# Altium schematic sheet LoRa_Transceiver.SchDoc
size A4; SheetNumber: 8; SheetTotal: 8
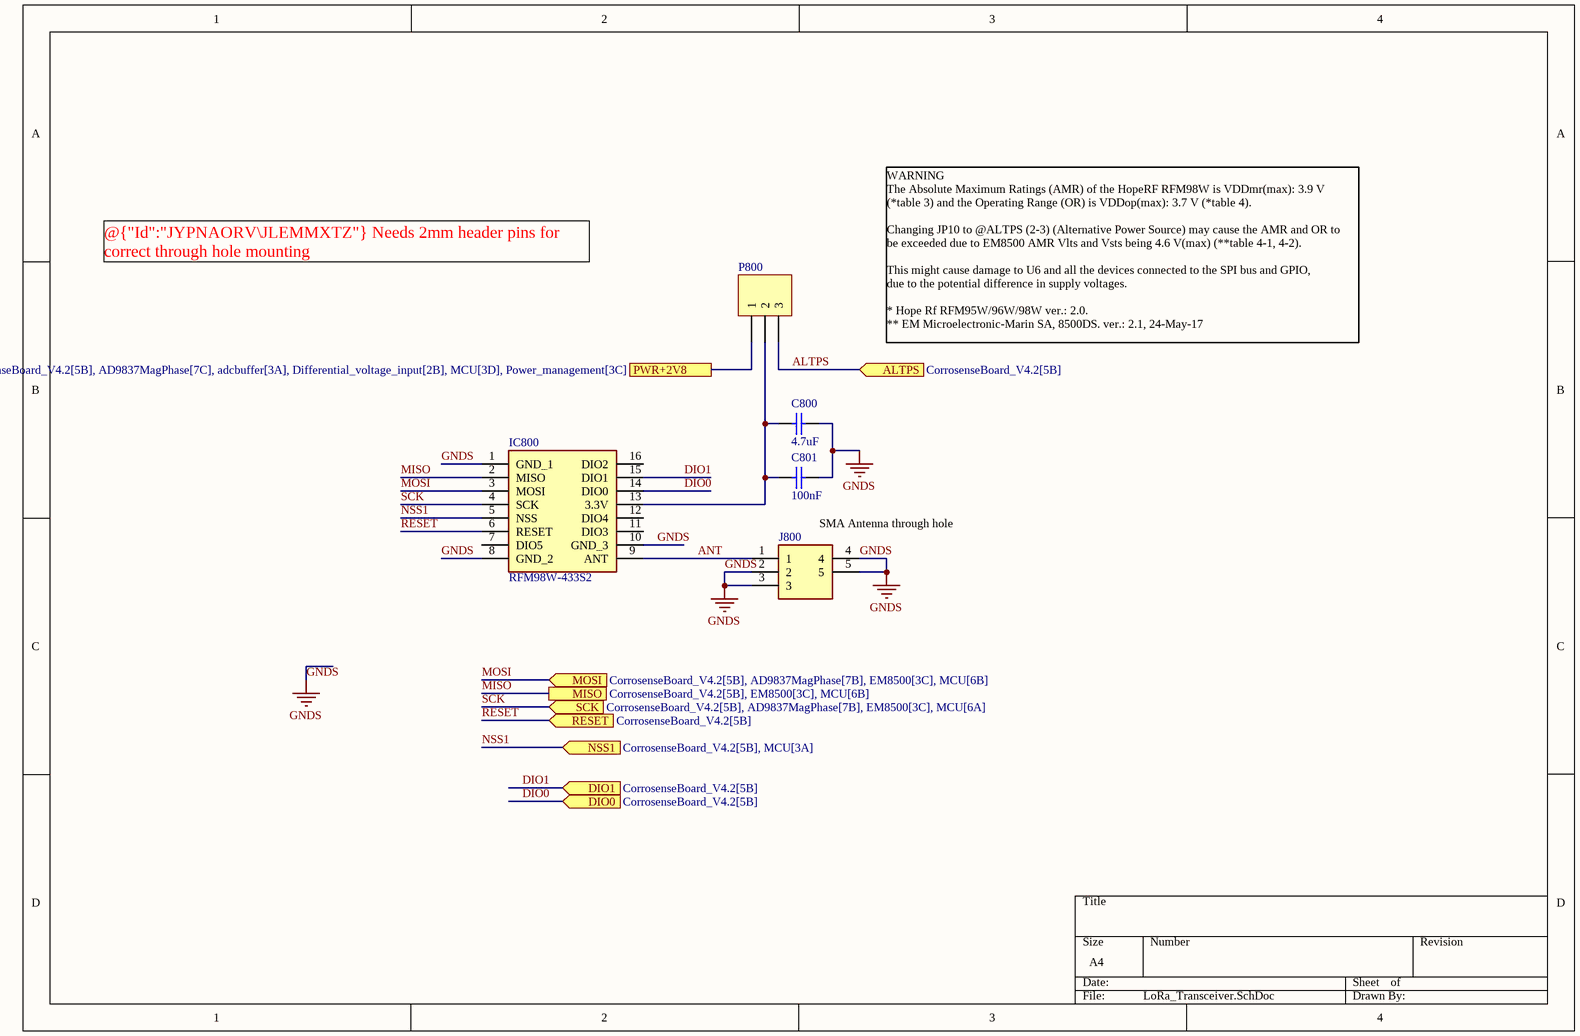
[diagram p0: LoRa_Transceiver.SchDoc]

## Parts
C800  4.7uF  [1608[0603]]
C801  100nF  [1608[0603]]
IC800  RFM98W-433S2  [RFM98W433S2]
J800  0733910070  [733910070]  (value not drawn)
P800  Header, 3-Pin  [HDR1X3]  (value not drawn)

## Ports
ALTPS (in, see CorrosenseBoard_V4.2[5B]), DIO0 (in, see CorrosenseBoard_V4.2[5B]), DIO1 (in, see CorrosenseBoard_V4.2[5B]), MISO (see CorrosenseBoard_V4.2[5B], EM8500[3C], MCU[6B]), MOSI (in, see CorrosenseBoard_V4.2[5B], AD9837MagPhase[7B], EM8500[3C], MCU[6B]), NSS1 (in, see CorrosenseBoard_V4.2[5B], MCU[3A]), PWR+2V8 (see CorrosenseBoard_V4.2[5B], AD9837MagPhase[7C], adcbuffer[3A], Differential_voltage_input[2B], MCU[3D], Power_management[3C]), RESET (in, see CorrosenseBoard_V4.2[5B]), SCK (in, see CorrosenseBoard_V4.2[5B], AD9837MagPhase[7B], EM8500[3C], MCU[6A])

## Nets
GNDS: C800.1 C801.1 IC800.1(GND_1) IC800.8(GND_2) IC800.10(GND_3) J800.2 J800.3 J800.4 J800.5
ALTPS: P800.3 ; port ALTPS
ANT: IC800.9(ANT) J800.1
DIO0: IC800.14(DIO0) ; port DIO0
DIO1: IC800.15(DIO1) ; port DIO1
MISO: IC800.2(MISO) ; port MISO
MOSI: IC800.3(MOSI) ; port MOSI
NSS1: IC800.5(NSS) ; port NSS1
PWR+2V8: P800.1 ; port PWR+2V8
RESET: IC800.6(RESET) ; port RESET
SCK: IC800.4(SCK) ; port SCK
NetC800_2: C800.2 C801.2 IC800.13(3.3V) P800.2

Not connected (* = marked no-connect by the designer): IC800 7(DIO5) 11(DIO3) 12(DIO4) 16(DIO2)

## Notes on the sheet
- Type @ to refer to a designator or a net
- @{"Id":"JYPNAORV\JLEMMXTZ"} Needs 2mm header pins for correct through hole mounting
- WARNING
  The Absolute Maximum Ratings (AMR) of the HopeRF RFM98W is VDDmr(max): 3.9 V
  (*table 3) and the Operating Range (OR) is VDDop(max): 3.7 V (*table 4).
  Changing JP10 to @ALTPS (2-3) (Alternative Power Source) may cause the AMR and OR to
  be exceeded due to EM8500 AMR Vlts and Vsts being 4.6 V(max) (**table 4-1, 4-2).
  This might cause damage to U6 and all the devices connected to the SPI bus and GPIO,
  due to the potential difference in supply voltages.
  * Hope Rf RFM95W/96W/98W ver.: 2.0.
  ** EM Microelectronic-Marin SA, 8500DS. ver.: 2.1, 24-May-17
- SMA Antenna through hole

## Library data of the parts
C800 = Cap: CAP CER 25V X7R 0603; Manufacturer: Murata Electronics; MPN: GRM188R61E475KE11J; Tolerance: ±10%; Value: 4.7uF; Operating Temperature: -55°C ~ 125°C; Package / Case: 0603 (1608 Metric); Temperature Coefficient: X7R; Voltage - Rated: 25V
C801 = Cap: CAP CER 25V X7R 0603; Manufacturer: Murata Electronics; MPN: GCJ188R71E104KA12D; Tolerance: ±10%; Value: 100nF; Operating Temperature: -55°C ~ 125°C; Package / Case: 0603 (1608 Metric); Temperature Coefficient: X7R; Voltage - Rated: 25V
IC800 = RFM98W-433S2: Integrated Circuit; Manufacturer_Name: RF SOLUTIONS; Datasheet Link: https://datasheet.datasheetarchive.com/originals/distributors/DKDS-13/248812.pdf; Height: 1.8mm; Manufacturer_Part_Number: RFM98W-433S2; Mouser Part Number: 223-RFM98W-433S2; Mouser Price/Stock: https://www.mouser.co.uk/ProductDetail/RF-Solutions/RFM98W-433S2?qs=OlC7AqGiEDlY9molZxTrLQ%3D%3D; Manufacturer: RF SOLUTIONS; MPN: RFM98W-433S2
J800 = 0733910070: Connector; Manufacturer_Name: Molex; MPN: 73391-0070; Datasheet Link: https://www.molex.com/pdm_docs/sd/733910070_sd.pdf; Height: 10mm; Manufacturer_Part_Number: 0733910070; Mouser Part Number: N/A; Mouser Price/Stock: https://www.mouser.co.uk/ProductDetail/Molex/0733910070?qs=PBcRNPEHKsq1tOlFMTxPGQ%3D%3D; Arrow Part Number: 0733910070; Arrow Price/Stock: https://www.arrow.com/en/products/0733910070/molex; Manufacturer: Molex
P800 = Header 3: Manufacturer: Wurth Elektronik; MPN: 61300311121; Publisher: Altium Limited